# EAGLE schematic Adafruit Feather STM32F405 Express (EAGLE 9.5.2)
COMPANY: ADAFRUIT INDUSTRIES; DRAWN: KTOWN; REV: B
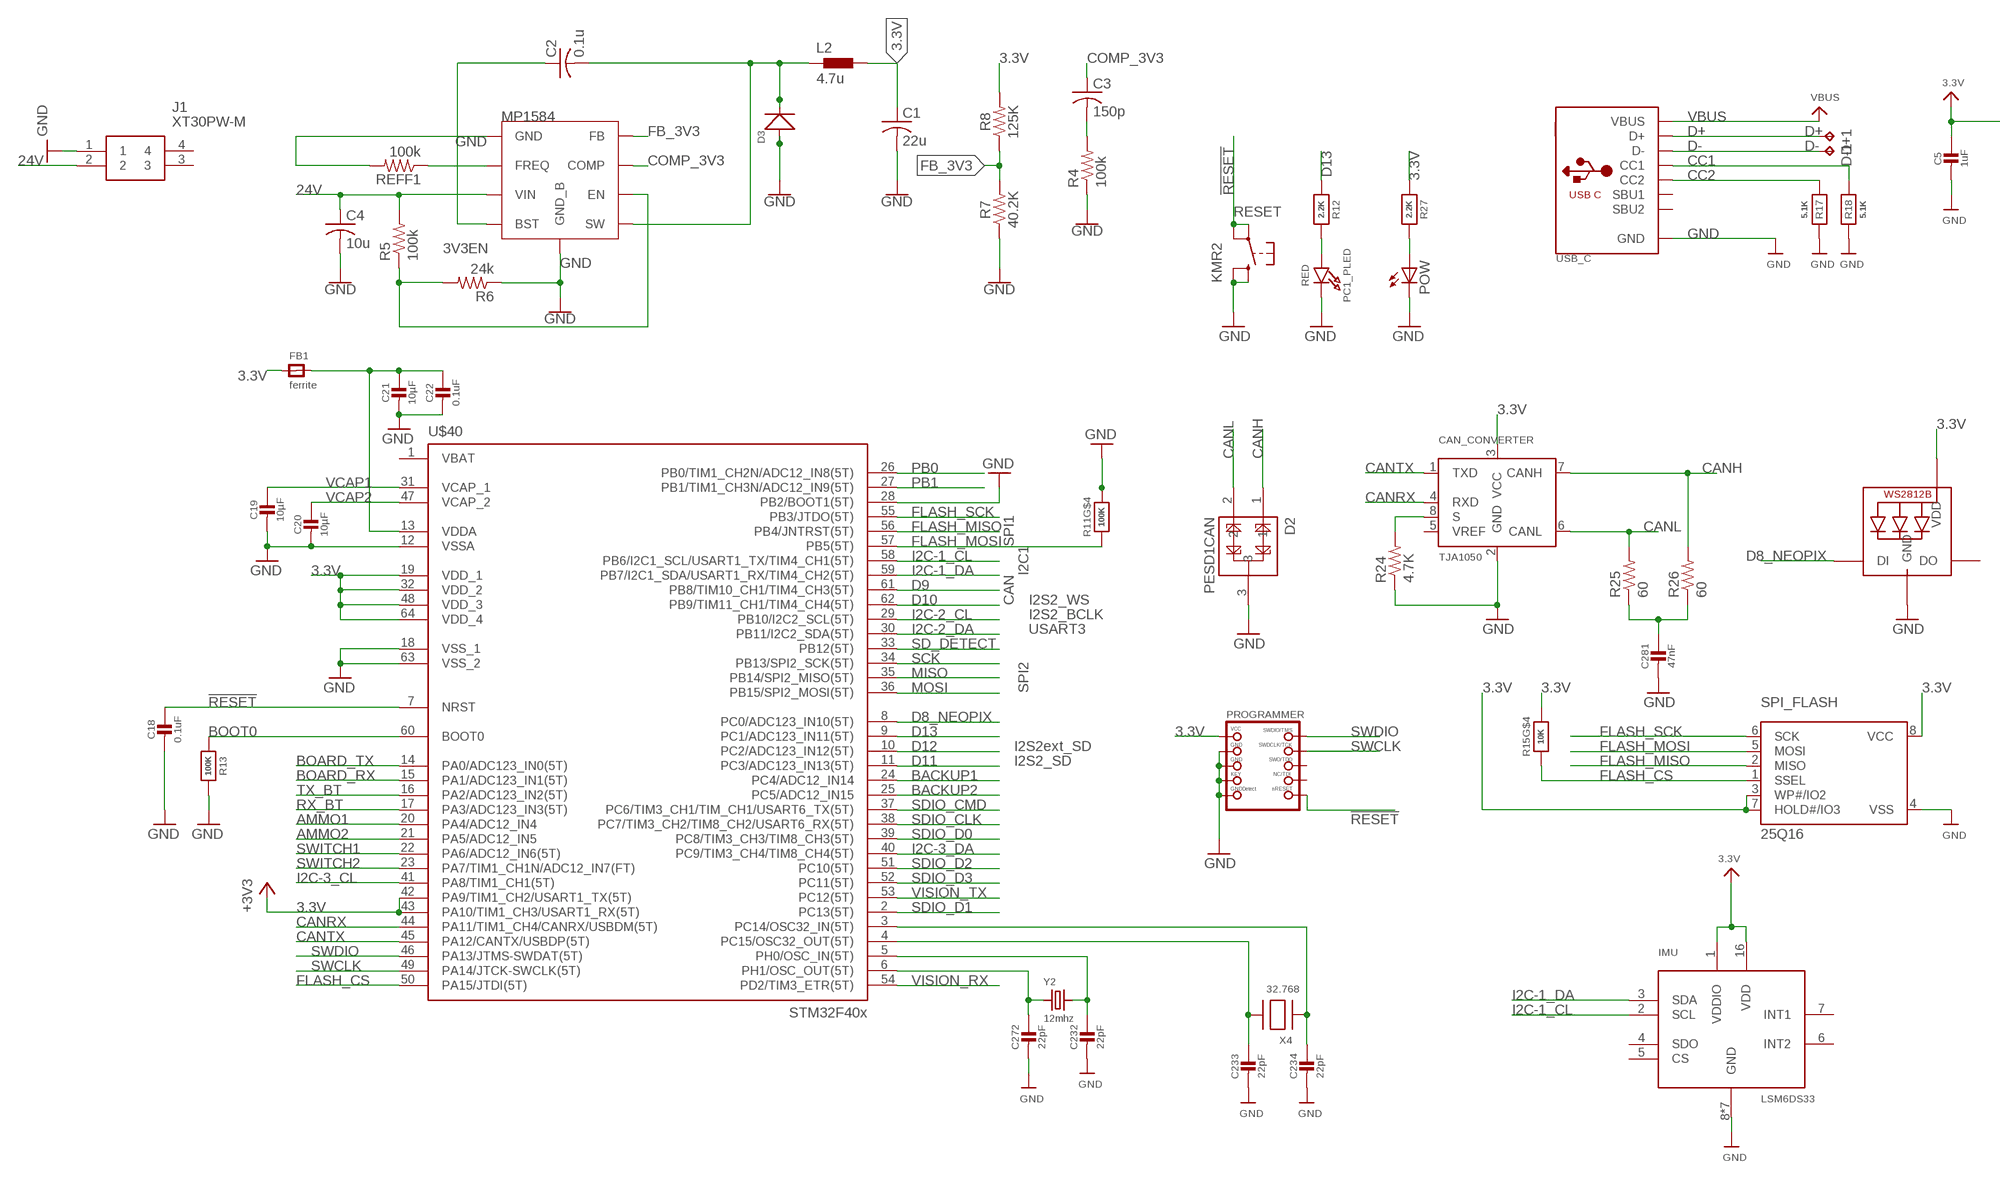
[diagram p0: schematic, sheet 1, part 1 of 2]
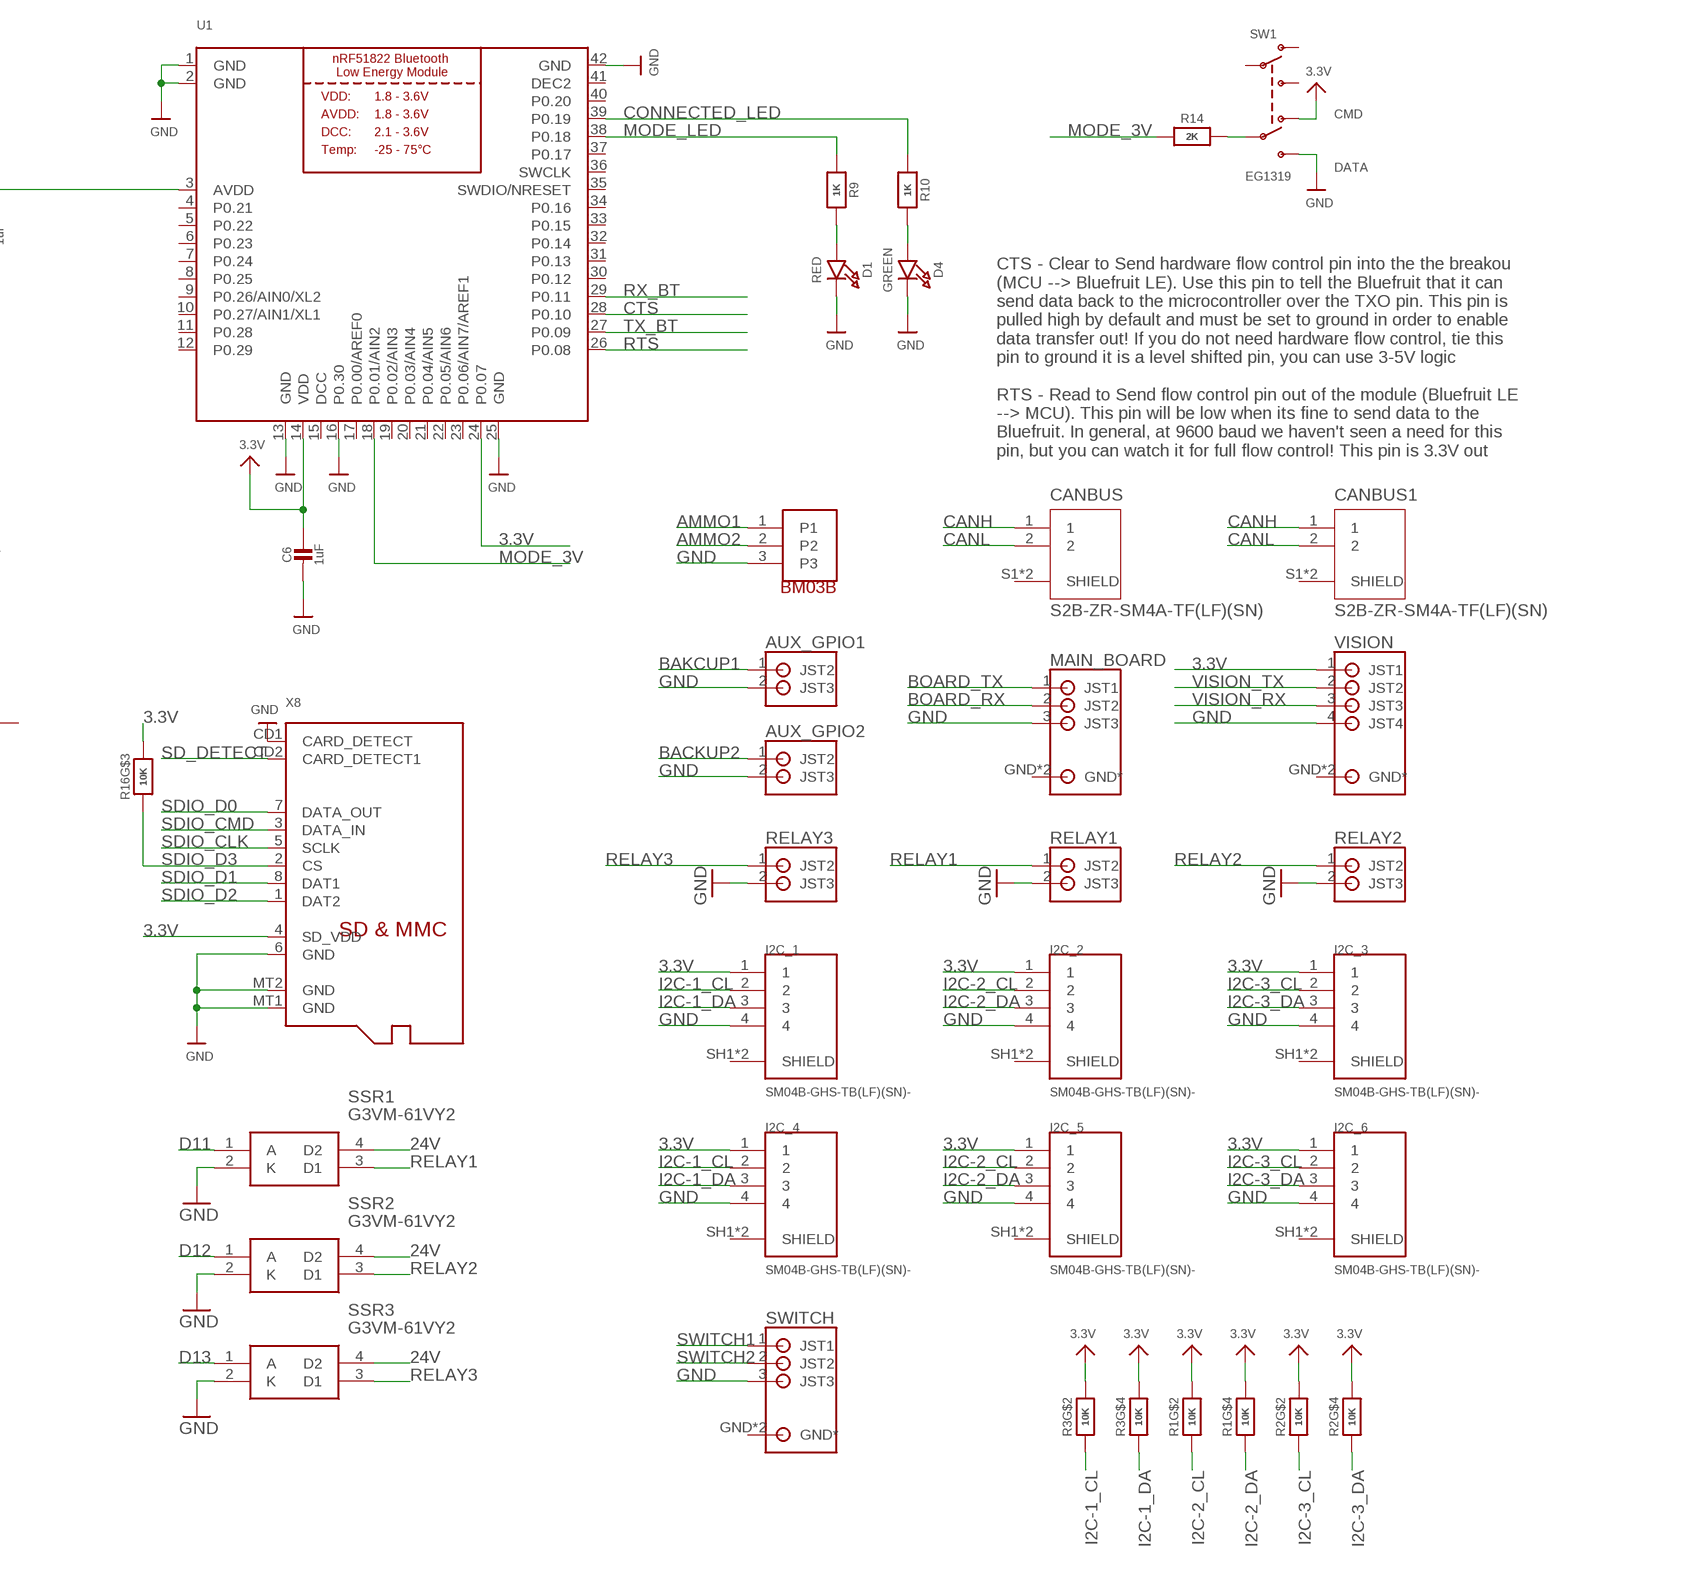
[diagram p1: schematic, sheet 1, part 2 of 2]

## Parts
AUX_GPIO1  S2B-PH-SM4_TB  [S2B-PH-SM4_TB]
AUX_GPIO2  S2B-PH-SM4_TB  [S2B-PH-SM4_TB]
C1  22u  C-USC1206  [C1206]
C2  0.1u  C-USC0603  [C0603]
C3  150p  C-USC0603  [C0603]
C4  10u  C-USC1206  [C1206]
C5  1uF  CAP_CERAMIC0805-NOOUTLINE  [0805-NO]
C6  1uF  CAP_CERAMIC0805-NOOUTLINE  [0805-NO]
C18  0.1uF  CAP_CERAMIC0603_NO  [0603-NO]
C19  10µF  CAP_CERAMIC0805-NOOUTLINE  [0805-NO]
C20  10µF  CAP_CERAMIC0805-NOOUTLINE  [0805-NO]
C21  10µF  CAP_CERAMIC0805-NOOUTLINE  [0805-NO]
C22  0.1uF  CAP_CERAMIC0603_NO  [0603-NO]
C23  22pF  CAP_4PACK1206  [RESPACK_4X0603]
C27  22pF  CAP_4PACK1206  [RESPACK_4X0603]
C28  47nF  CAP_4PACK1206  [RESPACK_4X0603]
CAN_CONVERTER  TJA1050  [SOT96-1]
CANBUS  S2B-ZR-SM4A-TF(LF)(SN)  [JST_S2B-ZR-SM4A-TF(LF)(SN)]
CANBUS1  S2B-ZR-SM4A-TF(LF)(SN)  [JST_S2B-ZR-SM4A-TF(LF)(SN)]
D1  RED  LED0805_NOOUTLINE  [CHIPLED_0805_NOOUTLINE]
D2  PESD1CAN  [SOT23-3]
D3  SMD-DIODE-SCHOTTKY-40V-3A(DO-214AB)  [DO-214AB]
D4  GREEN  LED0805_NOOUTLINE  [CHIPLED_0805_NOOUTLINE]
D+1  TPB1,27  [B1,27]
D-1  TPB1,27  [B1,27]
FB1  ferrite  FERRITE-0805NO  [0805-NO@1]
I2C_1  SM04B-GHS-TB(LF)(SN)-  [JST_SM04B-GHS-TB(LF)(SN)-]
I2C_2  SM04B-GHS-TB(LF)(SN)-  [JST_SM04B-GHS-TB(LF)(SN)-]
I2C_3  SM04B-GHS-TB(LF)(SN)-  [JST_SM04B-GHS-TB(LF)(SN)-]
I2C_4  SM04B-GHS-TB(LF)(SN)-  [JST_SM04B-GHS-TB(LF)(SN)-]
I2C_5  SM04B-GHS-TB(LF)(SN)-  [JST_SM04B-GHS-TB(LF)(SN)-]
I2C_6  SM04B-GHS-TB(LF)(SN)-  [JST_SM04B-GHS-TB(LF)(SN)-]
IMU  LSM6DS33  [LGA16_3X3MM]
J1  XT30PW-M  [XT30PWM]
L2  4.7u  MHCI0603-4R7M-R8  [MHCI0603-4R7M-R8]
LED2  WS2812B3535  [LED3535]
MAIN_BOARD  S3B-PH-SM4_TB  [S3B-PH-SM4_TB]
PC1_PLED  RED  LED0805_NOOUTLINE  [CHIPLED_0805_NOOUTLINE]
POW  LEDCHIPLED_0603  [CHIPLED_0603]
PROGRAMMER  JTAG-CORTEX  [2X05_1.27MM_SMT]
R1  10K  RESISTOR_4PACK  [RESPACK_4X0603]
R2  10K  RESISTOR_4PACK  [RESPACK_4X0603]
R3  10K  RESISTOR_4PACK  [RESPACK_4X0603]
R4  100k  R-US_R0603  [R0603]
R5  100k  R-US_R0603  [R0603]
R6  24k  R-US_R0603  [R0603]
R7  40.2K  220KOHM-0603-1/10W-1%  [0603]
R8  125K  RESISTOR0603  [0603]
R9  1K  RESISTOR0805_NOOUTLINE  [0805-NO]
R10  1K  RESISTOR0805_NOOUTLINE  [0805-NO]
R11  100K  RESISTOR_4PACK_NO  [RESPACK_4X0603_NO]
R12  2.2K  RESISTOR_0603_NOOUT  [0603-NO]
R13  100K  RESISTOR_0603_NOOUT  [0603-NO]
R14  2K  RESISTOR0805_NOOUTLINE  [0805-NO]
R15  10K  RESISTOR_4PACK_NO  [RESPACK_4X0603_NO]
R16  10K  RESISTOR_4PACK_NO  [RESPACK_4X0603_NO]
R17  5.1K  RESISTOR_0603_NOOUT  [0603-NO]
R18  5.1K  RESISTOR_0603_NOOUT  [0603-NO]
R24  4.7K  R-US_R0603  [R0603]
R25  60  R-US_R0603  [R0603]
R26  60  R-US_R0603  [R0603]
R27  2.2K  RESISTOR_0603_NOOUT  [0603-NO]
REFF1  100k  R-US_R0603  [R0603]
RELAY1  S2B-PH-SM4_TB  [S2B-PH-SM4_TB]
RELAY2  S2B-PH-SM4_TB  [S2B-PH-SM4_TB]
RELAY3  S2B-PH-SM4_TB  [S2B-PH-SM4_TB]
RESET  KMR2  SWITCH_TACT_SMT4.6X2.8  [BTN_KMR2_4.6X2.8]
SPI_FLASH  25Q16  SPIFLASH_8PIN  [SOIC8_150MIL]
SSR1  G3VM-61VY2  [SOP254P700X230-4N]
SSR2  G3VM-61VY2  [SOP254P700X230-4N]
SSR3  G3VM-61VY2  [SOP254P700X230-4N]
SW1  EG1319  SWITCH_DPDTEG1390  [EG1390]
SWITCH  S3B-PH-SM4_TB  [S3B-PH-SM4_TB]
U1  NRF51822_MODULE_MDBT40  [BLE_MODULE_RAYTAC_MDBT40]
U$6  BM03-GHS_TBT  [BM03-GHS-TBT]
U$10  MP1584_V2  [MP1584_V2]
U$40  STM32F405R  [TQFP64]
USB_C  USB_C  [USB_C_CUSB31-CFM2AX-01-X]
VISION  S4B-PH-SM4_TB  [S4B-PH-SM4_TB]
X4  32.768  XTAL-3.2X1.5  [XTAL3215]
X8  MICROSD  [MICROSD]
Y2  12mhz  CRYSTAL2.5X2.0  [CRYSTAL_2.5X2]

## Nets
3.3V: C1.1 C5.1 C6.1 CAN_CONVERTER.3(VCC) FB1.1 I2C_1.1 I2C_2.1 I2C_3.1 I2C_4.1 I2C_5.1 I2C_6.1 IMU.1(VDDIO) IMU.16(VDD) L2.P$2 LED2.2(VDD) PROGRAMMER.1(VCC) R1.2 R1.4 R2.2 R2.4 R3.2 R3.4 R8.2 R15.5 R16.6 R27.1 SPI_FLASH.3(WP#/IO2) SPI_FLASH.7(HOLD#/IO3) SPI_FLASH.8(VCC) SW1.O2 U1.3(AVDD) U1.14(VDD) U1.24(P0.07) U$40.19(VDD_1) U$40.32(VDD_2) U$40.42(PA9/TIM1_CH2/USART1_TX(5T)) U$40.43(PA10/TIM1_CH3/USART1_RX(5T)) U$40.48(VDD_3) U$40.64(VDD_4) VISION.1(JST1) X8.4(SD_VDD) ; supply symbol labelled +3V3
3V3EN: R5.1 R6.2 U$10.EN
24V [power]: C4.1 J1.2 R5.2 SSR1.4(D2) SSR2.4(D2) SSR3.4(D2) U$10.VIN
!RESET: C18.1 PROGRAMMER.10(NRESET) RESET.A'(P1) RESET.A(P) U$40.7(NRST)
AMMO1: U$6.1 U$40.20(PA4/ADC12_IN4)
AMMO2: U$6.2 U$40.21(PA5/ADC12_IN5)
BACKUP1: U$40.24(PC4/ADC12_IN14)
BACKUP2: AUX_GPIO2.1(JST2) U$40.25(PC5/ADC12_IN15)
BAKCUP1: AUX_GPIO1.1(JST2)
BOARD_RX: MAIN_BOARD.2(JST2) U$40.15(PA1/ADC123_IN1(5T))
BOARD_TX: MAIN_BOARD.1(JST1) U$40.14(PA0/ADC123_IN0(5T))
BOOT0: R13.1 U$40.60(BOOT0)
BST1: C2.1 U$10.BST
CANH: CAN_CONVERTER.7(CANH) CANBUS1.1 CANBUS.1 D2.1 R26.2
CANL: CAN_CONVERTER.6(CANL) CANBUS1.2 CANBUS.2 D2.2 R25.2
CANRX: CAN_CONVERTER.4(RXD) U$40.44(PA11/TIM1_CH4/CANRX/USBDM(5T))
CANTX: CAN_CONVERTER.1(TXD) U$40.45(PA12/CANTX/USBDP(5T))
CC1: R18.2 USB_C.A5(CC1)
CC2: R17.2 USB_C.B5(CC2)
COMP_3V3: C3.1 U$10.COMP
CONNECTED_LED: R10.1 U1.39(P0.19)
CTS: U1.28(P0.10)
D8_NEOPIX: LED2.1(DI) U$40.8(PC0/ADC123_IN10(5T))
D9: U$40.61(PB8/TIM10_CH1/TIM4_CH3(5T))
D10: U$40.62(PB9/TIM11_CH1/TIM4_CH4(5T))
D11: SSR1.1(A) U$40.11(PC3/ADC123_IN13(5T))
D12: SSR2.1(A) U$40.10(PC2/ADC123_IN12(5T))
D13: R12.1 SSR3.1(A) U$40.9(PC1/ADC123_IN11(5T))
D+: D+1.TP USB_C.A6(D+) USB_C.B6(D+)
D-: D-1.TP USB_C.A7(D-) USB_C.B7(D-)
FB_3V3: R7.2 R8.1 U$10.FB
FLASH_CS: R15.4 SPI_FLASH.1(SSEL) U$40.50(PA15/JTDI(5T))
FLASH_MISO: SPI_FLASH.2(MISO) U$40.56(PB4/JNTRST(5T))
FLASH_MOSI: R11.4 SPI_FLASH.5(MOSI) U$40.57(PB5(5T))
FLASH_SCK: SPI_FLASH.6(SCK) U$40.55(PB3/JTDO(5T))
FREQ1: REFF1.1 U$10.FREQ
GND [gnd]: AUX_GPIO1.2(JST3) AUX_GPIO2.2(JST3) C1.2 C4.2 C5.2 C6.2 C18.2 C19.2 C20.2 C21.2 C22.2 C23.5 C23.6 C23.7 C27.7 C28.8 CAN_CONVERTER.2(GND) D1.C D2.3 D3.1(+) D4.C I2C_1.4 I2C_2.4 I2C_3.4 I2C_4.4 I2C_5.4 I2C_6.4 IMU.8(GND) IMU.9(GND) IMU.10(GND) IMU.11(GND) IMU.12(GND) IMU.13(GND) IMU.15(GND) J1.1 LED2.4(GND) MAIN_BOARD.3(JST3) PC1_PLED.C POW.C PROGRAMMER.3(GND) PROGRAMMER.5(GND) PROGRAMMER.7(KEY) PROGRAMMER.9(GNDDETECT) R4.1 R6.1 R7.1 R11.5 R13.2 R17.1 R18.1 R24.1 REFF1.2 RELAY1.2(JST3) RELAY2.2(JST3) RELAY3.2(JST3) RESET.B'(S1) RESET.B(S) SPI_FLASH.4(VSS) SSR1.2(K) SSR2.2(K) SSR3.2(K) SW1.S2 SWITCH.3(JST3) U1.1(GND) U1.2(GND) U1.13(GND) U1.16(P0.30) U1.25(GND) U1.42(GND) U$6.3 U$10.GND U$10.GND_B U$40.12(VSSA) U$40.18(VSS_1) U$40.28(PB2/BOOT1(5T)) U$40.63(VSS_2) USB_C.A1B12(GND) USB_C.B1A12(GND) VISION.4(JST4) X8.6(GND) X8.CD1(CARD_DETECT) X8.MT1(GND) X8.MT2(GND)
I2C-1_CL: I2C_1.2 I2C_4.2 IMU.2(SCL) R3.7 U$40.58(PB6/I2C1_SCL/USART1_TX/TIM4_CH1(5T))
I2C-1_DA: I2C_1.3 I2C_4.3 IMU.3(SDA) R3.5 U$40.59(PB7/I2C1_SDA/USART1_RX/TIM4_CH2(5T))
I2C-2_CL: I2C_2.2 I2C_5.2 R1.7 U$40.29(PB10/I2C2_SCL(5T))
I2C-2_DA: I2C_2.3 I2C_5.3 R1.5 U$40.30(PB11/I2C2_SDA(5T))
I2C-3_CL: I2C_3.2 I2C_6.2 R2.7 U$40.41(PA8/TIM1_CH1(5T))
I2C-3_DA: I2C_3.3 I2C_6.3 R2.5 U$40.40(PC9/TIM3_CH4/TIM8_CH4(5T))
MISO: U$40.35(PB14/SPI2_MISO(5T))
MODE_3V: R14.1 U1.18(P0.01/AIN2)
MODE_LED: R9.1 U1.38(P0.18)
MOSI: U$40.36(PB15/SPI2_MOSI(5T))
N$3: C3.2 R4.2
N$4: R14.2 SW1.P2
N$5: D1.A R9.2
N$6: D4.A R10.2
N$9: C23.4 U$40.3(PC14/OSC32_IN(5T)) X4.P$1
N$10: C23.3 U$40.4(PC15/OSC32_OUT(5T)) X4.P$2
N$11: C23.2 U$40.5(PH0/OSC_IN(5T)) Y2.3
N$12: C27.2 U$40.6(PH1/OSC_OUT(5T)) Y2.1
N$13: PC1_PLED.A R12.2
N$20: C21.1 C22.1 FB1.2 U$40.13(VDDA)
N$21: CAN_CONVERTER.8(S) R24.2
N$22: C28.1 R25.1 R26.1
N$23: POW.A R27.2
PB0: U$40.26(PB0/TIM1_CH2N/ADC12_IN8(5T))
PB1: U$40.27(PB1/TIM1_CH3N/ADC12_IN9(5T))
RELAY1: RELAY1.1(JST2) SSR1.3(D1)
RELAY2: RELAY2.1(JST2) SSR2.3(D1)
RELAY3: RELAY3.1(JST2) SSR3.3(D1)
RTS: U1.26(P0.08)
RX_BT: U1.29(P0.11) U$40.17(PA3/ADC123_IN3(5T))
SCK: U$40.34(PB13/SPI2_SCK(5T))
SD_DETECT: U$40.33(PB12(5T)) X8.CD2(CARD_DETECT1)
SDIO_CLK: U$40.38(PC7/TIM3_CH2/TIM8_CH2/USART6_RX(5T)) X8.5(SCLK)
SDIO_CMD: U$40.37(PC6/TIM3_CH1/TIM_CH1/USART6_TX(5T)) X8.3(DATA_IN)
SDIO_D0: U$40.39(PC8/TIM3_CH3/TIM8_CH3(5T)) X8.7(DATA_OUT)
SDIO_D1: U$40.2(PC13(5T)) X8.8(DAT1)
SDIO_D2: U$40.51(PC10(5T)) X8.1(DAT2)
SDIO_D3: R16.3 U$40.52(PC11(5T)) X8.2(CS)
SW1: C2.2 D3.2(-) L2.P$1 U$10.SW
SWCLK: PROGRAMMER.4(SWDCLK) U$40.49(PA14/JTCK-SWCLK(5T))
SWDIO: PROGRAMMER.2(SWDIO) U$40.46(PA13/JTMS-SWDAT(5T))
SWITCH1: SWITCH.1(JST1) U$40.22(PA6/ADC12_IN6(5T))
SWITCH2: SWITCH.2(JST2) U$40.23(PA7/TIM1_CH1N/ADC12_IN7(FT))
TX_BT: U1.27(P0.09) U$40.16(PA2/ADC123_IN2(5T))
VBUS [power]: USB_C.A4B9(VBUS) USB_C.B4A9(VBUS)
VCAP1: C19.1 U$40.31(VCAP_1)
VCAP2: C20.1 U$40.47(VCAP_2)
VISION_RX: U$40.54(PD2/TIM3_ETR(5T)) VISION.3(JST3)
VISION_TX: U$40.53(PC12(5T)) VISION.2(JST2)
Unconnected: C23.1 C23.8 C27.1 C27.3 C27.4 C27.5 C27.6 C27.8 C28.2 C28.3 C28.4 C28.5 C28.6 C28.7 CAN_CONVERTER.5(VREF) CANBUS1.S1(SHIELD) CANBUS1.S2(SHIELD) CANBUS.S1(SHIELD) CANBUS.S2(SHIELD) IMU.4(SDO) IMU.5(CS) IMU.6(INT2) IMU.7(INT1) J1.3 J1.4 LED2.3(DO) MAIN_BOARD.GND2(GND*) MAIN_BOARD.GND(GND*) PROGRAMMER.6(SWO) PROGRAMMER.8(TDI) R1.1 R1.3 R1.6 R1.8 R2.1 R2.3 R2.6 R2.8 R3.1 R3.3 R3.6 R3.8 R11.1 R11.2 R11.3 R11.6 R11.7 R11.8 R15.1 R15.2 R15.3 R15.6 R15.7 R15.8 R16.1 R16.2 R16.4 R16.5 R16.7 R16.8 SW1.O1 SW1.P1 SW1.S1 SWITCH.GND2(GND*) SWITCH.GND(GND*) U1.4(P0.21) U1.5(P0.22) U1.6(P0.23) U1.7(P0.24) U1.8(P0.25) U1.9(P0.26/AIN0/XL2) U1.10(P0.27/AIN1/XL1) U1.11(P0.28) U1.12(P0.29) U1.17(P0.00/AREF0) U1.19(P0.02/AIN3) U1.20(P0.03/AIN4) U1.21(P0.04/AIN5) U1.22(P0.05/AIN6) U1.23(P0.06/AIN7/AREF1) U1.30(P0.12) U1.31(P0.13) U1.32(P0.14) U1.33(P0.15) U1.34(P0.16) U1.35(SWDIO/NRESET) U1.36(SWCLK) U1.37(P0.17) U1.40(P0.20) U$40.1(VBAT) USB_C.A8(SBU1) USB_C.B8(SBU2) VISION.GND2(GND*) VISION.GND(GND*)

## Notes on the sheet
- CMD
- DATA
- CTS - Clear to Send hardware flow control pin into the the breakou 
  (MCU --> Bluefruit LE). Use this pin to tell the Bluefruit that it can 
  send data back to the microcontroller over the TXO pin. This pin is 
  pulled high by default and must be set to ground in order to enable 
  data transfer out! If you do not need hardware flow control, tie this 
  pin to ground it is a level shifted pin, you can use 3-5V logic
  
  RTS - Read to Send flow control pin out of the module (Bluefruit LE 
  --> MCU). This pin will be low when its fine to send data to the 
  Bluefruit. In general, at 9600 baud we haven't seen a need for this 
  pin, but you can watch it for full flow control! This pin is 3.3V out
- SPI1
- I2C1
- CAN | I2S2_WS
- I2S2_BCLK
- USART3
- SPI2
- I2S2ext_SD
- I2S2_SD

## Power pins joined to a net without a drawn wire
DCC: U1.15(DCC)
DEC2: U1.41(DEC2)
SHIELD: I2C_1.SH1(SHIELD) I2C_1.SH2(SHIELD) I2C_2.SH1(SHIELD) I2C_2.SH2(SHIELD) I2C_3.SH1(SHIELD) I2C_3.SH2(SHIELD) I2C_4.SH1(SHIELD) I2C_4.SH2(SHIELD) I2C_5.SH1(SHIELD) I2C_5.SH2(SHIELD) I2C_6.SH1(SHIELD) I2C_6.SH2(SHIELD)

## Library data of the parts
AUX_GPIO1 AUX_GPIO2 RELAY1-RELAY3 = KevinMade:S2B-PH-SM4_TB
C1-C4 = adafruit:C-US: CAPACITOR, American symbol
C5 C6 C18-C22 = microbuilder:CAP_CERAMIC: Ceramic Capacitors For new designs, use the packages preceded by an '_' character since they are more reliable: The following footprints should be used on most boards: _0402 - Standard footprint for regular board layouts _0603 - Standard footprint for regular board layouts _0805 - Standard footprint for regular board layouts _1206 - Standard footprint for regular board layouts For extremely tight-pitch boards where space is at a premium, the following 'micro-pitch' footprints can be used (smaller pads, no silkscreen outline, etc.): _0402MP - Micro-pitch footprint for very dense/compact boards _0603MP - Micro-pitch footprint for very dense/compact boards _0805MP - Micro-pitch footprint for very dense/compact boards _1206MP - Micro-pitch footprint for very dense/compact boards
C23 C27 C28 = microbuilder:CAP_4PACK
CAN_CONVERTER = TJA1050:TJA1050: High speed CAN transceiver The TJA1050 is the interface between the Controller Area Network (CAN) protocol controller and the physical bus. The device provides differential transmit capability to the bus and differential receive capability to the CAN controller. The TJA1050 is the third Philips high-speed CAN transceiver after the PCA82C250 and the PCA82C251. The most important differences are: Much lower electromagnetic emission due to optimal matching of the output signals CANH and CANL Improved behaviour in case of an unpowered node No standby mode. This makes the TJA1050 eminently suitable for use in nodes that are in a power-down situation in partially powered networks. AAL Eindhoven MK; AVAILABILITY: Unavailable; DESCRIPTION: 1/1 Transceiver Half CANbus 8-SO; MF: NXP USA; MP: TJA1050; PACKAGE: SOIC-8 NXP USA; PRICE: None
CANBUS CANBUS1 = S2B-ZR-SM4A-TF_LF__SN_:S2B-ZR-SM4A-TF(LF)(SN): ZH Series 2 Position 1.5 mm Pitch Surface Mount Side Entry Shrouded Header; AVAILABILITY: Unavailable; DESCRIPTION: Connector Header Surface Mount, Right Angle 2 position 0.059 _1.50mm_; MF: JST Sales; MP: S2B-ZR-SM4A-TF_LF__SN_; PACKAGE: None; PRICE: None
D1 D4 PC1_PLED = microbuilder:LED: LED
D2 = PESD1CAN:PESD1CAN: PESD1CAN is used to protect two automotive CAN bus lines from ESD.; AVAILABILITY: Unavailable; DESCRIPTION: 50V Clamp 3A _8/20µs_ Ipp Tvs Diode Surface Mount SC-70; MF: NXP Semiconductors; MP: PESD1CAN; PACKAGE: SC-70 NXP Semiconductors; PRICE: None
D3 = SMD-DIODE-SCHOTTKY-40V-3A_DO-214AB_:SMD-DIODE-SCHOTTKY-40V-3A(DO-214AB): 304020018; AVAILABILITY: Unavailable; DESCRIPTION: Rectifier, Schottky; DO-214AB; 3.0A IF; 0.75V; 40V; 100A IFRM; 10000V/us; 1000pF; MF: Vishay; MP: SS34-E3/57T; PACKAGE: DO-214 Vishay; PRICE: None
D+1 D-1 = testpad:TP: Test pad
FB1 = microbuilder:FERRITE: Ferrite Bead 0603 MMZ1608B121C - 120 Ohm @ 100MHz, 600mA, 0.15 Ohm DC Resistance - Digikey: 445-2164-1-ND BK1608HW121-T - 120 Ohm, 600mA Ferrite Chip - Digikey: 587-1876-2-ND 0805 HZ0805B272R-10 - 2.7K Ohm @ 100MHz, 200mA, 0.8 Ohm DC Resistance - Digikey: 240-2504-1-ND (see also Murata BLM21BD272SN1L) MMZ2012Y152B - 1.5K Ohm @ 100MHz, 500mA, 0.4 Ohm DC Resistance - Digikey: 445-1560-1-ND - Mainly for high frequency (80-400MHz) MMZ2012R102A - 1K Ohm @ 100MHz, 500mA, 0.3 Ohm DC Resistance - Digikey: 445-1555-2-ND - More general purpose (10-200MHz)
I2C_1-I2C_6 = SM04B-GHS-TB_LF__SN_-:SM04B-GHS-TB(LF)(SN)-: Conn Header Gh Side 4pos 1.25mm; AVAILABILITY: Unavailable; DESCRIPTION: Connector Header Surface Mount, Right Angle 4 position 0.049 _1.25mm_; MF: JST Sales; MP: SM04B-GHS-TB_LF__SN_-; PACKAGE: None; PRICE: None
IMU = adafruit_sensor:LSM6DS33
J1 = SamacSys_Parts:XT30PW-M: 30A Low Temperature Rise Fire Retardant Plug Source: Datasheet <https://www.tme.eu/sl/Document/ce4077e36b79046da520ca73227e15de/XT30PW SPEC.pdf>; DESCRIPTION: 30A Low Temperature Rise Fire Retardant Plug; HEIGHT: 5mm; MANUFACTURER_NAME: Amass; MANUFACTURER_PART_NUMBER: XT30PW-M
L2 = NewKevinMade:MHCI0603-4R7M-R8
LED2 = microbuilder:WS2812B
MAIN_BOARD SWITCH = KevinMade:S3B-PH-SM4_TB
POW = adafruit:LED: LED
PROGRAMMER = microbuilder:JTAG-CORTEX: Serial Wire (SW-DP) Connector Standard 0.05" 10-pin connector is for use with the Cortex M and Cortex A SWD (serial wire debugger) interface (SW-DP) Connectors 2x05_1.27MM_SMT - Inexpensive surface-mount header with bare pins, compatible with standard 10-pin SWD cables (4UCON: 16846) 2x05_1.27MM_BOX_NOPOSTS - Polarised surface-mount box (4UCON with caps: 19735, without caps: 15117 2x05_1.27MM_BOX_POSTS - Polarised surface-mount box with mounting holes (4UCON: 20317) Pinout: http://infocenter.arm.com/help/topic/com.arm.doc.faqs/attached/13634/cortex_debug_connectors.pdf http://www.keil.com/peripherals/coresight/connectors.asp
R1-R3 R11 R15 R16 = microbuilder:RESISTOR_4PACK: Resistor Packs (4 resistors) 4 x 0603 10K 1/16W - Digikey: YC164J-10KCT-ND
R4-R6 R24-R26 REFF1 = adafruit:R-US_: RESISTOR, American symbol
R7 = SparkFun-Resistors:220KOHM: 220kΩ resistor A resistor is a passive two-terminal electrical component that implements electrical resistance as a circuit element. Resistors act to reduce current flow, and, at the same time, act to lower voltage levels within circuits. - Wikipedia; PROD_ID: RES-08969; VALUE: 220k
R8 = SparkFun-Resistors:RESISTOR: Generic Resistor Package
R9 R10 R12-R14 R17 R18 R27 = microbuilder:RESISTOR: Resistors For new designs, use the packages preceded by an '_' character since they are more reliable: The following footprints should be used on most boards: _0402 - Standard footprint for regular board layouts _0603 - Standard footprint for regular board layouts _0805 - Standard footprint for regular board layouts _1206 - Standard footprint for regular board layouts For extremely tight-pitch boards where space is at a premium, the following 'micro-pitch' footprints can be used (smaller pads, no silkscreen outline, etc.): _0402MP - Micro-pitch footprint for very dense/compact boards _0603MP - Micro-pitch footprint for very dense/compact boards _0805MP - Micro-pitch footprint for very dense/compact boards _1206MP - Micro-pitch footprint for very dense/compact boards
RESET = microbuilder:SWITCH_TACT_SMT: SMT Tact Switches 6x6mm - Digikey: P12940SCT-ND KMR2 (4.6x2.8mm) - Digikey: 401-1426-1-ND EVQ-PQHB55 - Light Touch, 160GF (4.5x4.5mm) - Digikey: P8090SCT-ND KMT0 - KMT021 NGJ LHS (etc.) IP68/Waterproof - Digikey: CKN10289CT-ND
SPI_FLASH = microbuilder:SPIFLASH_8PIN: SOIC8 SPI Flash Be careful with the size since SOIC8 flash comes in several 'widths' SOIC8 150 mil M25P16 - 16Mbit (2Mbit x 8) Serial Flash (75MHz SPI Bus), Supply: 2.7-3.6V Digikey: SOIC8 - M25P16-VMN6P-ND SOIC8 208 mil W25Q16BVSSIG - 16Mbit (2Mbit x 8) Serial Flash (104MHz SPI Bus), Supply: 2.7-3.6V Digikey: SOIC8 - W25Q16BVSSIG-ND
SSR1-SSR3 = SamacSys_Parts:G3VM-61VY2: Solid State Relays - PCB Mount Mos Fet Relay, SMT 60V, 1 form A,SOP4 Source: Datasheet <https://componentsearchengine.com/Datasheets/1/G3VM-61VY2.pdf>; DESCRIPTION: Solid State Relays - PCB Mount Mos Fet Relay, SMT 60V, 1 form A,SOP4; HEIGHT: 2.3mm; MANUFACTURER_NAME: Omron Electronics; MANUFACTURER_PART_NUMBER: G3VM-61VY2; MOUSER_PART_NUMBER: 653-G3VM61VY2; MOUSER_PRICE-STOCK: https://www.mouser.com/Search/Refine.aspx?Keyword=653-G3VM61VY2
SW1 = microbuilder:SWITCH_DPDT: Switch - DPDT A DPDT Switch acts like an SPDT switch, but has a pair of switches instead of just one. Vertical - 0.3A @ 6V SMT - Digikey: JS202011SCQN
U1 = microbuilder:NRF51822_MODULE_MDBT40: nRF51822 Bluetooth Low Energy Module
U$6 = SamacSys_Parts:BM03-GHS_TBT
U$10 = mp1584S:MP1584_V2
U$40 = adafruit_micro:STM32F405R: STM32F405 64 pin LQFP reviewed: YES tested: YES
USB_C = microbuilder:USB_C: USB Type-C USB 2.0 Connector
VISION = KevinMade:S4B-PH-SM4_TB
X4 = adafruit2:XTAL: Low cost SMT crystals, no capacitors included http://www.ladyada.net/library/eagle
X8 = microbuilder:MICROSD: MicroSD/Transflash Card Holder with SPI pinout 3M: 2908-05WB-MG 4UConnector: 19656 Footprint courtesy: Adafruit Industries
Y2 = microbuilder:CRYSTAL: Crystals HC49UP - Surface Mount Crystal 4.0MHz 18pF +/-30ppm Surface Mount Crystal [Digikey: 535-9857-1-ND] 12.0 MHz Surface Mount Crystal [Digikey: 535-9869-6-ND] 25.0 MHz Surface Mount Crystal [Digikey: 535-9078-1-ND] 2.5 x 2.0mm - MEMs SMT Crystal 16.0 MHz 10pF 20ppm 2.5 x 2.0mm Crystal [Digikey -40-85°C: 535-10923-1-ND] 3.2 x 2.5mm - MEMs SMT Crystal 12.0 MHz 8pF 15ppm 3.2 x 2.5mm Crystal [Digikey: -10-70°C: 644-1047-1-ND -40-125°C: 644-1128-1-ND] 40~85°C cheaper: 644-1173-6-ND 16.0 MHz 8pF 15ppm 3.2 x 2.5mm Crystal [Digikey: -10-70°C: 644-1049-1-ND -40-125°C: 644-1129-2-ND]-40~85°C cheaper: 644-1175-6-ND 16.0 MHz 10pF 10ppm 3.2 x 2.5mm Crystal [Digikey: 644-1100-1-ND] 27.12 MHz 18pF 30ppm 3.2 x 2.5mm Crystal [Digikey: 887-1424-1-ND] 27.12MHz 10pF 10ppm 3.2 x 2.5mm Crystal [Digikey: 887-1329-1-ND] 4.9 x 1.8mm - MEMs SMT Crystal 32.768 KHz 12.5pF 20ppm 4.9 x 1.8mm Crystal [Digikey: SE2415CT-ND] 8.0 x 3.8mm - Surface Mount Crystal 32.768kHz 12.5pF 20ppm -40°C-85°C [Digikey: 535-9166-2-ND] Cylinder 32.768KHz Cylinder Crystal (2x6mm body) [Ex. Digikey: 300-8341-2-ND]

## Net classes
1 power: width 0.305 mm
2 gnd: width 0.254 mm